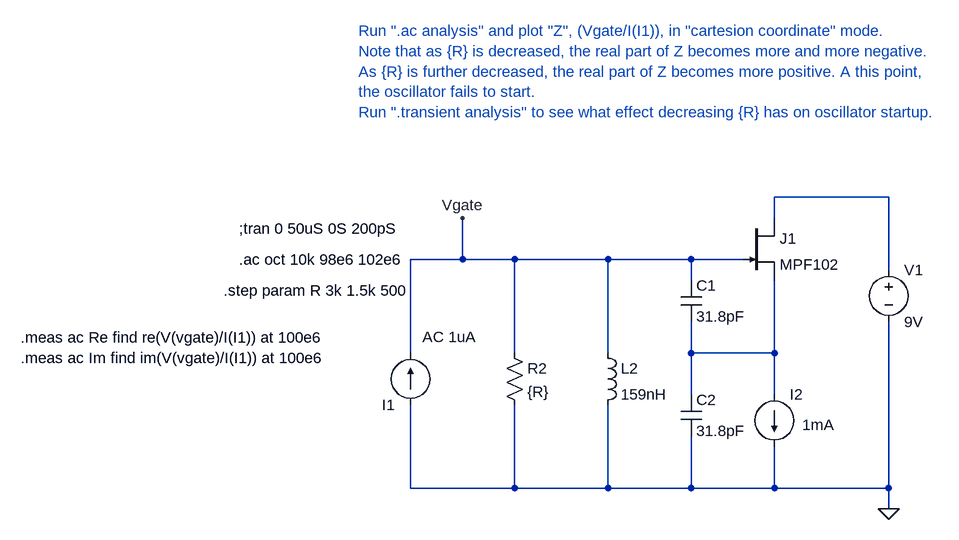
[diagram p0: schematic osc_impedance.asc]
osc_impedance.asc, the LTspice schematic file:
Version 4
SHEET 1 880 884
WIRE -736 416 -736 272
WIRE -736 624 -736 496
WIRE -656 272 -736 272
WIRE -656 272 -656 208
WIRE -576 272 -656 272
WIRE -576 416 -576 272
WIRE -576 624 -736 624
WIRE -576 624 -576 496
WIRE -432 272 -576 272
WIRE -432 416 -432 272
WIRE -432 624 -576 624
WIRE -432 624 -432 496
WIRE -304 272 -432 272
WIRE -304 304 -304 272
WIRE -304 416 -304 368
WIRE -304 480 -304 416
WIRE -304 624 -432 624
WIRE -304 624 -304 544
WIRE -224 272 -304 272
WIRE -176 208 -176 176
WIRE -176 416 -304 416
WIRE -176 416 -176 304
WIRE -176 480 -176 416
WIRE -176 624 -304 624
WIRE -176 624 -176 560
WIRE 0 176 -176 176
WIRE 0 288 0 176
WIRE 0 624 -176 624
WIRE 0 624 0 368
WIRE 0 656 0 624
FLAG 0 656 0
FLAG -656 208 Vgate
SYMBOL voltage 0 272 R0
WINDOW 123 0 0 Left 0
WINDOW 39 0 0 Left 0
SYMATTR InstName V1
SYMATTR Value 9V
SYMBOL cap -320 304 R0
SYMATTR InstName C1
SYMATTR Value 31.8pF
SYMBOL cap -320 480 R0
SYMATTR InstName C2
SYMATTR Value 31.8pF
SYMBOL njf -224 208 R0
SYMATTR InstName J1
SYMATTR Value MPF102
SYMBOL current -736 496 R180
WINDOW 123 -101 105 Left 0
WINDOW 3 24 88 Invisible 0
SYMATTR Value2 AC 1uA
SYMATTR Value ""
SYMATTR InstName I1
SYMBOL ind -448 400 R0
SYMATTR InstName L2
SYMATTR Value 159nH
SYMATTR SpiceLine Rser=0
SYMBOL res -592 400 R0
SYMATTR InstName R2
SYMATTR Value {R}
SYMBOL current -176 480 R0
WINDOW 123 24 116 Left 0
WINDOW 39 0 0 Left 0
WINDOW 3 43 47 Left 0
SYMATTR Value 1mA
SYMATTR InstName I2
TEXT -1000 224 Left 0 !;tran 0 50uS 0S 200pS
TEXT -1000 272 Left 0 !.ac oct 10k 98e6 102e6
TEXT -1024 320 Left 0 !.step param R 3k 1.5k 500
TEXT -816 -80 Left 0 ;Run ".ac analysis" and plot "Z", (Vgate/I(I1)), in "cartesion coordinate" mode.\nNote that as {R} is decreased, the real part of Z becomes more and more negative.\nAs {R} is further decreased, the real part of Z becomes more positive. A this point,\nthe oscillator fails to start.\nRun ".transient analysis" to see what effect decreasing {R} has on oscillator startup.
TEXT -1336 392 Left 0 !.meas ac Re find re(V(vgate)/I(I1)) at 100e6\n.meas ac Im find im(V(vgate)/I(I1)) at 100e6

The netlist it stands for:
* osc_impedance.asc
V1 N002 0 9V
C1 Vgate N001 31.8pF
C2 N001 0 31.8pF
J1 N002 Vgate N001 MPF102
I1 0 Vgate AC 1uA
L2 Vgate 0 159nH Rser=0
R2 Vgate 0 {R}
I2 N001 0 1mA
.model NJF NJF
.model PJF PJF
.lib standard.jft
;tran 0 50uS 0S 200pS
.ac oct 10k 98e6 102e6
.step param R 3k 1.5k 500
* Run ".ac analysis" and plot "Z", (Vgate/I(I1)), in "cartesion coordinate" mode.
* Note that as {R} is decreased, the real part of Z becomes more and more negative.
* As {R} is further decreased, the real part of Z becomes more positive. A this point,
* the oscillator fails to start.
* Run ".transient analysis" to see what effect decreasing {R} has on oscillator startup.
.meas ac Re find re(V(vgate)/I(I1)) at 100e6
.meas ac Im find im(V(vgate)/I(I1)) at 100e6
.backanno
.end